# EAGLE design lightmeter_external_batt_circuit (EAGLE 9.6.2)
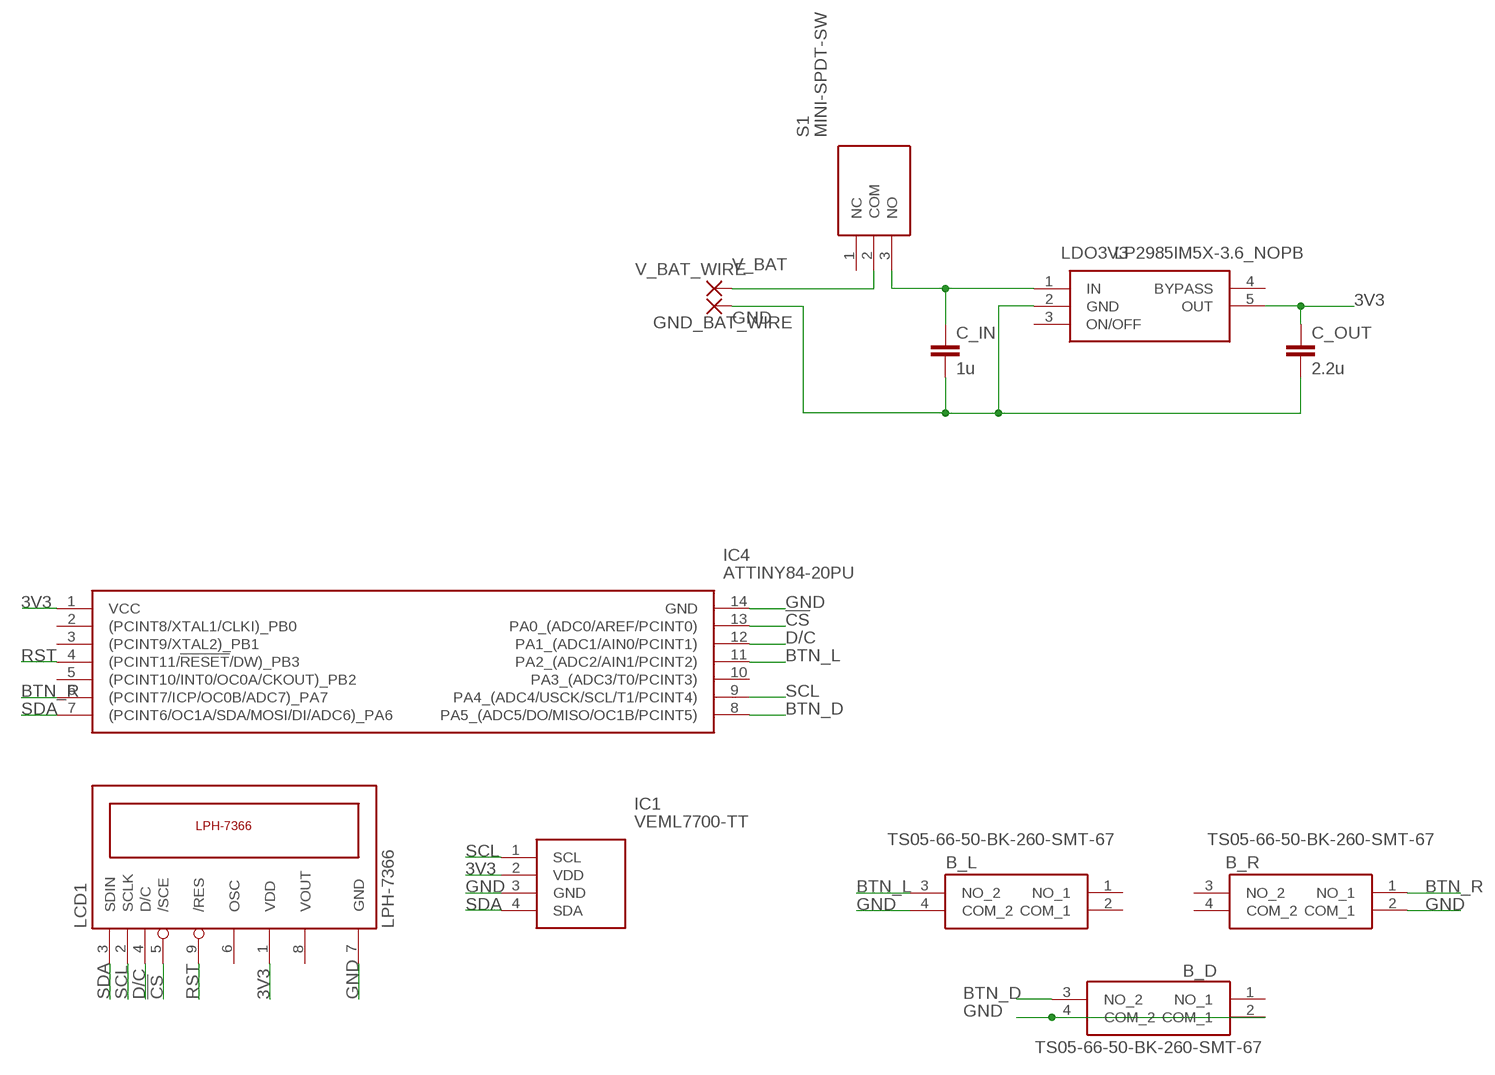
[diagram p0: schematic, sheet 1]

## Parts
B_D  TS05-66-50-BK-260-SMT-67  [TS056650BK260SMT67]
B_L  TS05-66-50-BK-260-SMT-67  [TS056650BK260SMT67]
B_R  TS05-66-50-BK-260-SMT-67  [TS056650BK260SMT67]
C_IN  1u  C-EUC3216  [C3216]
C_OUT  2.2u  C-EUC3216  [C3216]
GND_BAT_WIRE  2,54/0,9  [2,54/0,9]
IC1  VEML7700-TT  [VEML7700]
IC4  ATTINY84-20PU  [DIP794W56P254L1918H533Q14N]
LCD1  LPH-7366  [LPH-7366]
LDO3V3  LP2985IM5X-3.6_NOPB  [SOT95P280X145-5N]
S1  MINI-SPDT-SW  [MINISPDTSW]
V_BAT_WIRE  2,54/0,9  [2,54/0,9]

## Nets
3V3: C_OUT.1 IC1.2(VDD) IC4.1(VCC) LCD1.1(VDD) LDO3V3.5(OUT)
!CS: IC4.13(PA0_(ADC0/AREF/PCINT0)) LCD1.5(/SCE)
BTN_D: B_D.3(NO_2) IC4.8(PA5_(ADC5/DO/MISO/OC1B/PCINT5))
BTN_L: B_L.3(NO_2) IC4.11(PA2_(ADC2/AIN1/PCINT2))
BTN_R: B_R.1(NO_1) IC4.6((PCINT7/ICP/OC0B/ADC7)_PA7)
D/C: IC4.12(PA1_(ADC1/AIN0/PCINT1)) LCD1.4(D/C)
GND: B_D.2(COM_1) B_D.4(COM_2) B_L.4(COM_2) B_R.2(COM_1) C_IN.2 C_OUT.2 GND_BAT_WIRE.1(P) IC1.3(GND) IC4.14(GND) LCD1.7(GND) LDO3V3.2(GND)
N$1: C_IN.1 LDO3V3.1(IN) S1.3(NO)
RST: IC4.4((PCINT11/!RESET!/DW)_PB3) LCD1.9(/RES)
SCL: IC1.1(SCL) IC4.9(PA4_(ADC4/USCK/SCL/T1/PCINT4)) LCD1.2(SCLK)
SDA: IC1.4(SDA) IC4.7((PCINT6/OC1A/SDA/MOSI/DI/ADC6)_PA6) LCD1.3(SDIN)
V_BAT: S1.2(COM) V_BAT_WIRE.1(P)
Unconnected: B_D.1(NO_1) B_L.1(NO_1) B_L.2(COM_1) B_R.3(NO_2) B_R.4(COM_2) IC4.2((PCINT8/XTAL1/CLKI)_PB0) IC4.3((PCINT9/XTAL2)_PB1) IC4.5((PCINT10/INT0/OC0A/CKOUT)_PB2) IC4.10(PA3_(ADC3/T0/PCINT3)) LCD1.6(OSC) LCD1.8(VOUT) LDO3V3.3(ON/OFF) LDO3V3.4(BYPASS) S1.1(NC)

## Library data of the parts
B_D B_L B_R = SamacSys_Parts:TS05-66-50-BK-260-SMT-67: Tactile Switches 6 x 6 mm, 5 mm Act Height, 260 gf, Black, Surface Mount, IP67, SPST, Source: Datasheet <https://www.cuidevices.com/product/resource/ts05.pdf>; DESCRIPTION: Tactile Switches 6 x 6 mm, 5 mm Act Height, 260 gf, Black, Surface Mount, IP67, SPST,; HEIGHT: 5.2mm; MANUFACTURER_NAME: CUI Inc.; MANUFACTURER_PART_NUMBER: TS05-66-50-BK-260-SMT-67; MOUSER_PART_NUMBER: 179-TS056650260SMT67; MOUSER_PRICE-STOCK: https://www.mouser.co.uk/ProductDetail/CUI-Devices/TS05-66-50-BK-260-SMT-67?qs=A6eO%252BMLsxmTTpMlvA87NHQ%3D%3D
C_IN C_OUT = rcl:C-EU: CAPACITOR, European symbol; SPICEPREFIX: C
GND_BAT_WIRE V_BAT_WIRE = wirepad:2,54/0,9: THROUGH-HOLE PAD
IC1 = SamacSys_Parts:VEML7700-TT: 16Bit Ambient Light Sensor I2C 6.8x2.3mm Source: Datasheet <https://www.arrow.com/en/products/veml7700-tt/vishay>; DESCRIPTION: 16Bit Ambient Light Sensor I2C 6.8x2.3mm; HEIGHT: mm; MANUFACTURER_NAME: Vishay; MANUFACTURER_PART_NUMBER: VEML7700-TT; MOUSER_PART_NUMBER: 78-VEML7700-TT; MOUSER_PRICE-STOCK: https://www.mouser.co.uk/ProductDetail/Vishay-Semiconductors/VEML7700-TT?qs=BcfjnG7NVaXdL6DJFdWbdw%3D%3D
IC4 = SamacSys_Parts:ATTINY84-20PU: Microcontroller AVR, 8KB FLASH, 512B EE ATTINY84-20PU, 8 bit AVR Microcontroller 20MHz 512 B, 8 kB Flash, 512 B RAM, I2C 14-Pin PDIP Source: Datasheet <https://datasheet.datasheetarchive.com/originals/distributors/Datasheets_SAMA/1a4ee99e4eb61e76f001b846a746d522.pdf>; DESCRIPTION: Microcontroller AVR, 8KB FLASH, 512B EE ATTINY84-20PU, 8 bit AVR Microcontroller 20MHz 512 B, 8 kB Flash, 512 B RAM, I2C 14-Pin PDIP; HEIGHT: 5.334mm; MANUFACTURER_NAME: Microchip; MANUFACTURER_PART_NUMBER: ATTINY84-20PU; MOUSER_PART_NUMBER: 556-ATTINY84-20PU; MOUSER_PRICE-STOCK: https://www.mouser.co.uk/ProductDetail/Microchip-Technology-Atmel/ATTINY84-20PU?qs=2nyfZ6BV3ohef4pLj0igDg%3D%3D
LCD1 = lph-7366:LPH-7366
LDO3V3 = SamacSys_Parts:LP2985IM5X-3.6_NOPB: Micropower 150-mA Low-Noise Ultra-Low-Dropout Regulator in SOT-23 packages Source: Datasheet <http://www.ti.com/lit/gpn/lp2985-n>; DESCRIPTION: Micropower 150-mA Low-Noise Ultra-Low-Dropout Regulator in SOT-23 packages; HEIGHT: 1.45mm; MANUFACTURER_NAME: Texas Instruments; MANUFACTURER_PART_NUMBER: LP2985IM5X-3.6/NOPB; MOUSER_PART_NUMBER: 926-LP2985IM5X36NOPB; MOUSER_PRICE-STOCK: https://www.mouser.co.uk/ProductDetail/Texas-Instruments/LP2985IM5X-36-NOPB?qs=7lkVKPoqpbYgOQm7zq4eUg%3D%3D
S1 = SamacSys_Parts:MINI-SPDT-SW: Slide Switches MINI SPDT SWITCH Source: Datasheet <http://site.gravitech.us/Components/MINI-SPDT-SW/EG1218_datasheet.pdf>; DESCRIPTION: Slide Switches MINI SPDT SWITCH; HEIGHT: mm; MANUFACTURER_NAME: Gravitech; MANUFACTURER_PART_NUMBER: MINI-SPDT-SW; MOUSER_PART_NUMBER: 992-MINI-SPDT-SW; MOUSER_PRICE-STOCK: https://www.mouser.co.uk/ProductDetail/Gravitech/MINI-SPDT-SW?qs=Vxac6xGyzPm8ENq695r3yA%3D%3D

## Board
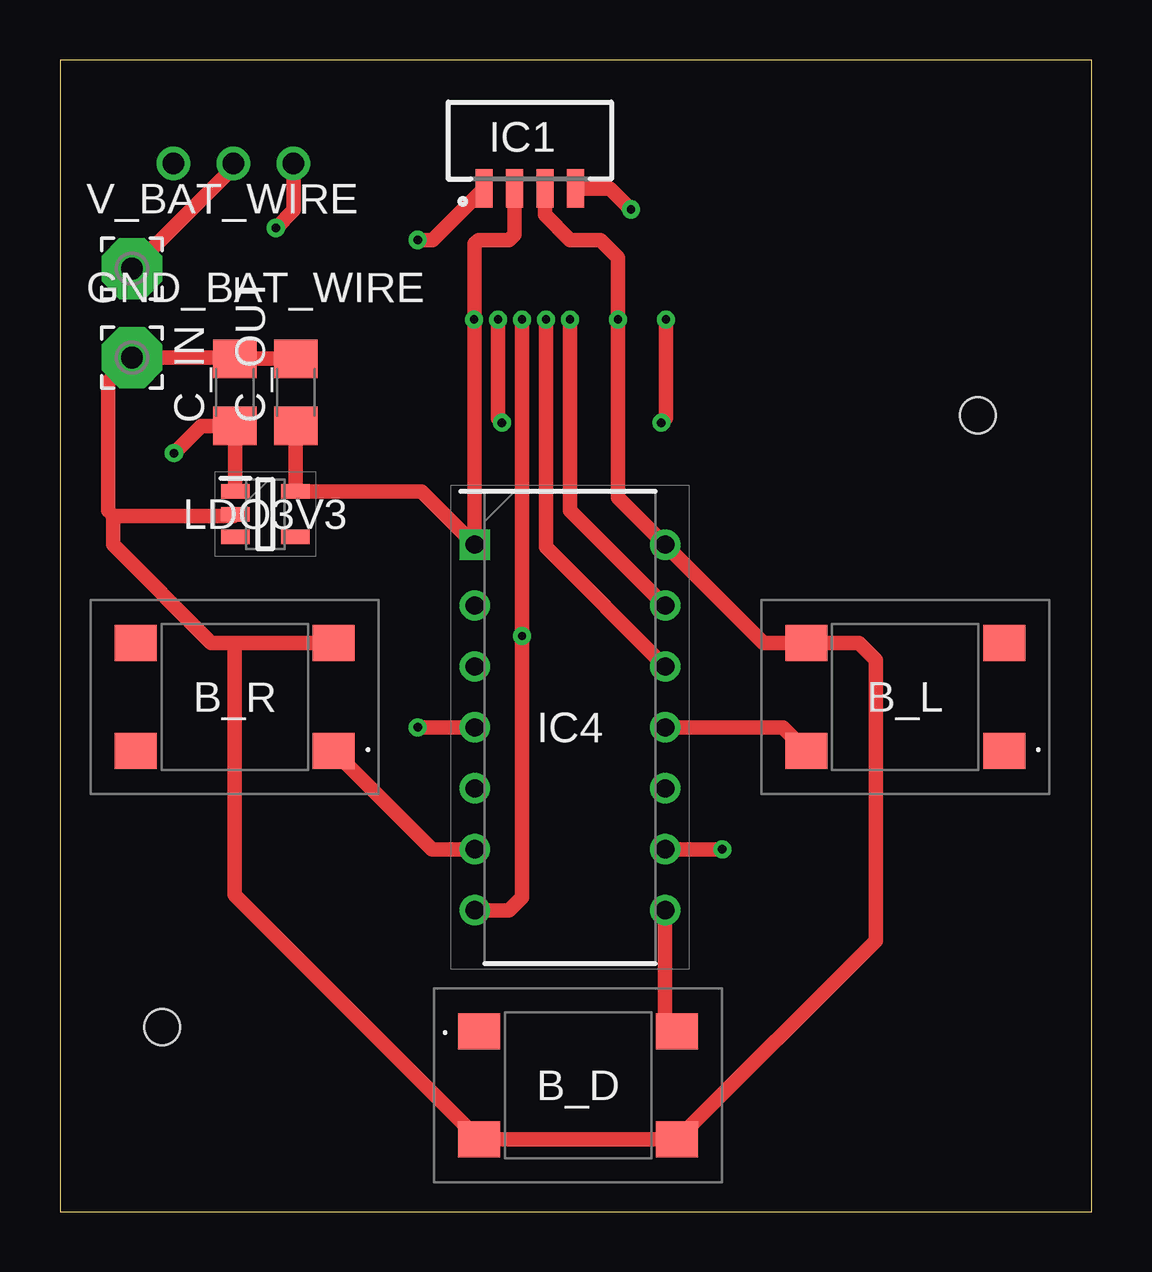
[diagram p1: board, top side]
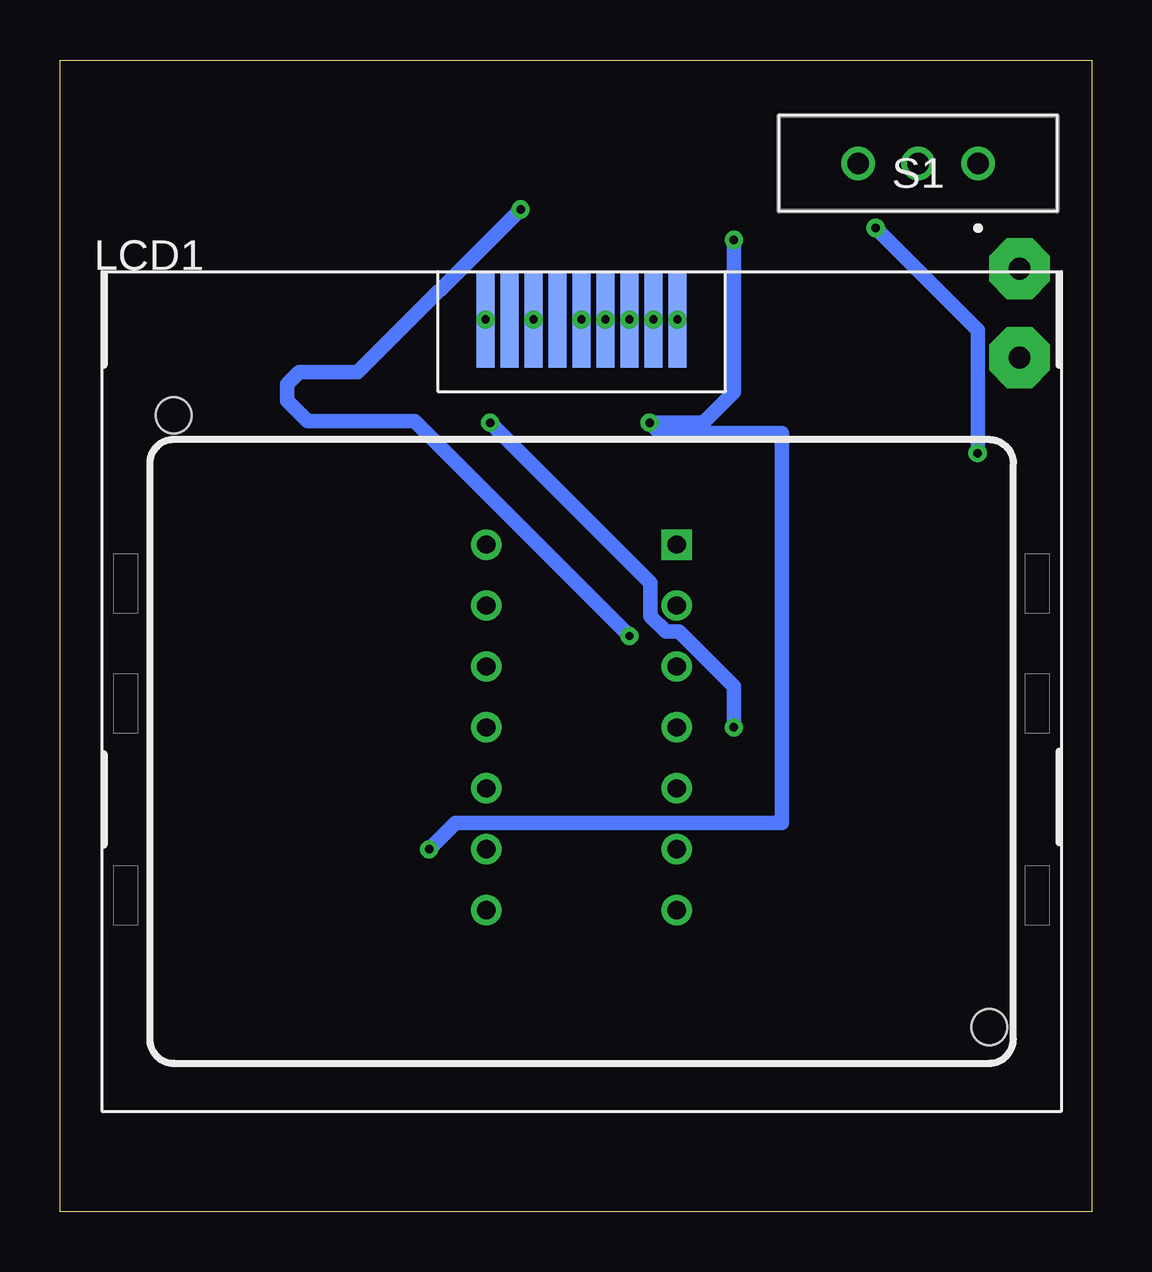
[diagram p2: board, bottom side, seen from below]

Size 43 x 48 mm. Coordinates in mm from the lower left corner, seen from the top.
Outline: 0,0 43,0 43,48 0,48 0,0
Copper layers (1*16): Top 0.035mm / dielectric 1.5mm / Bottom 0.035mm
Design rules "default": minimum track width 6mil, minimum drill 0.35mm, track to track 6mil, track to pad 6mil, pad to pad 6mil, via to via 6mil, smd to smd 6mil, copper to edge 40mil, drill to drill 6mil, minimum pad ring 10mil, minimum via ring 8mil, stop-mask expansion 4mil, vias tented up to drill 0mil, thermal gap 10mil

### Footprints (pad centres in the part's own frame; a part is rotated, then mirrored left to right if it is on the bottom)
TS056650BK260SMT67 = smd 1.75 x 1.5: 1 -4.125,2.25; 2 -4.125,-2.25; 3 4.125,2.25; 4 4.125,-2.25
C3216 = smd 1.6 x 1.8: 1 -1.4,0; 2 1.4,0
2,54/0,9 = drill 0.914 pad 2.54 octagon: 1 0,0
VEML7700 = smd 0.7 x 1.6: 1 1.495,-0.4; 2 2.765,-0.4; 3 4.035,-0.4; 4 5.305,-0.4
DIP794W56P254L1918H533Q14N = drill 0.759 pad 1.159 square: 1 -3.969,7.62 | drill 0.759 pad 1.159: 2 -3.969,5.08; 3 -3.969,2.54; 4 -3.969,0; 5 -3.969,-2.54; 6 -3.969,-5.08; 7 -3.969,-7.62; 8 3.969,-7.62; 9 3.969,-5.08; 10 3.969,-2.54; 11 3.969,0; 12 3.969,2.54; 13 3.969,5.08; 14 3.969,7.62
LPH-7366 = smd 0.75 x 4: 1 4,17; 2 3,17; 3 2,17; 4 1,17; 5 0,17; 6 -1,17; 7 -2,17; 8 -3,17; 9 -4,17 | hole 1.5: -17,13; 17,-12.5
SOT95P280X145-5N = smd 1.2 x 0.6: 1 -1.25,0.95; 2 -1.25,0; 3 -1.25,-0.95; 4 1.25,-0.95; 5 1.25,0.95
MINISPDTSW = drill 0.9 pad 1.4: 1 -2.5,0; 2 0,0; 3 2.5,0

### Placement (x,y rotation side)
B_D  21.6,5.26 0 top
B_L  35.23,21.45 180 top
B_R  7.29,21.45 180 top
C_IN  7.29,34.15 90 top
C_OUT  9.83,34.15 90 top
GND_BAT_WIRE  3,35.6 0 top
IC1  16.18,43.04 0 top
IC4  21.26,20.18 0 top
LCD1  21.26,20.18 0 bottom
LDO3V3  8.56,29.07 0 top
S1  7.23,43.69 180 bottom
V_BAT_WIRE  3,39.3 0 top

### Tracks (layer width: path | path; a pad name or v marks a point on that pad's centre or on a via)
3V3  (via drill 0.35)
  Top 0.61: 17.29,37.15 IC4.1 15.07,30.02 LDO3V3.5 9.83,30.04 C_OUT.1 | 17.29,37.15 LCD1.1 | IC1.2 18.95,40.73 18.72,40.5 17.45,40.5 17.29,40.34 17.29,37.15
  other vias: 17.26,37.18
!CS  (via drill 0.35)
  Top 0.61: IC4.13 21.26,29.23 LCD1.5
  other vias: 21.26,37.18
BTN_D
  Top 0.61: B_D.3 25.23,8.01 IC4.8
BTN_L
  Top 0.61: IC4.11 30.12,20.18 B_L.3
BTN_R
  Top 0.61: B_R.1 15.52,15.1 IC4.6
D/C  (via drill 0.35)
  Top 0.61: IC4.12 20.26,27.69 LCD1.4
  other vias: 20.26,37.18
GND  (via drill 0.35)
  Top 0.61: 2.21,29 2.21,27.8 6.31,23.7 7.29,23.7 | B_R.2 7.29,23.7 | 7.29,23.7 7.29,13.2 B_D.2 B_D.4 34,11.29 34,23 33.3,23.7 B_L.4 29.33,23.7 IC4.14 23.26,29.77 LCD1.7 23.26,39.77 22.53,40.5 21.26,40.5 20.21,41.55 IC1.3 | C_OUT.2 C_IN.2 7.24,35.6 GND_BAT_WIRE.1 2,34.6 2,29.21 2.21,29 | LDO3V3.2 7.24,29 2.21,29
  other vias: 23.26,37.18
N$1  (via drill 0.35)
  Top 0.61: LDO3V3.1 7.31,32.73 C_IN.1 5.89,32.75 v4.75,31.61 | S1.3 9.73,41.73 v9,41
  Bottom 0.61: v4.75,31.61 4.75,36.75 v9,41
RST  (via drill 0.35)
  Top 0.61: IC4.4 v14.91,20.18 | v25.07,32.88 25.26,33.07 LCD1.9
  Bottom 0.61: v25.07,32.88 18.38,26.19 18.38,24.81 17.74,24.17 17.2,24.17 14.91,21.88 v14.91,20.18
  other vias: 25.26,37.18
SCL  (via drill 0.35)
  Top 0.61: IC4.9 v27.61,15.1 | v18.43,32.88 18.26,33.05 LCD1.2 | IC1.1 15.54,40.5 v14.91,40.5
  Bottom 0.61: v27.61,15.1 26.52,16.19 12.91,16.19 12.91,32.45 17.99,32.45 v18.43,32.88 16.18,32.88 14.91,34.15 v14.91,40.5
  other vias: 18.26,37.18
SDA  (via drill 0.35)
  Top 0.61: IC4.7 18.72,12.56 19.26,13.1 v19.26,23.99 LCD1.3 | IC1.4 22.93,42.64 v23.8,41.77
  Bottom 0.61: v19.26,23.99 28.22,32.95 32.67,32.95 33.52,33.8 33.52,34.5 33.04,34.98 30.59,34.98 v23.8,41.77
  other vias: 19.26,37.18
V_BAT
  Top 0.61: V_BAT_WIRE.1 7.23,43.53 S1.2